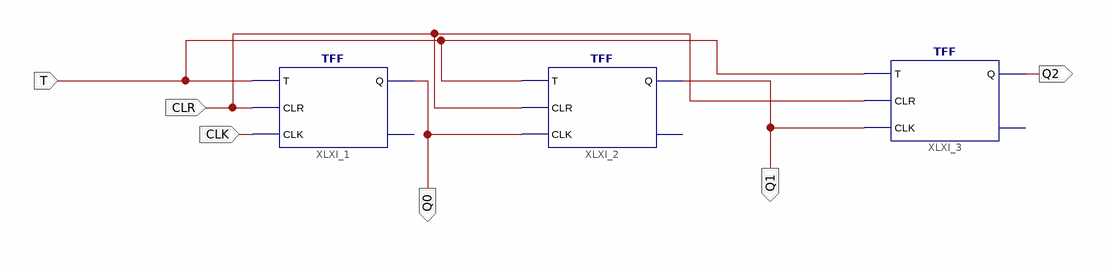
[diagram p0: schematic sheet 1]
// Xilinx ISE schematic asyc_counter.sch (spartan3a) as structural Verilog: 3 symbols, 6 ports
module asyc_counter (
  input  T,
  input  CLR,
  input  CLK,
  output Q2,
  output Q0,
  output Q1
);

  TFF XLXI_1 (.T(T), .CLR(CLR), .CLK(CLK), .Q(Q0));  // open: Qb
  TFF XLXI_2 (.T(T), .CLR(CLR), .CLK(Q0), .Q(Q1));  // open: Qb
  TFF XLXI_3 (.T(T), .CLR(CLR), .CLK(Q1), .Q(Q2));  // open: Qb
endmodule
